# EAGLE design reprap32_drv1sch (EAGLE 5.11)
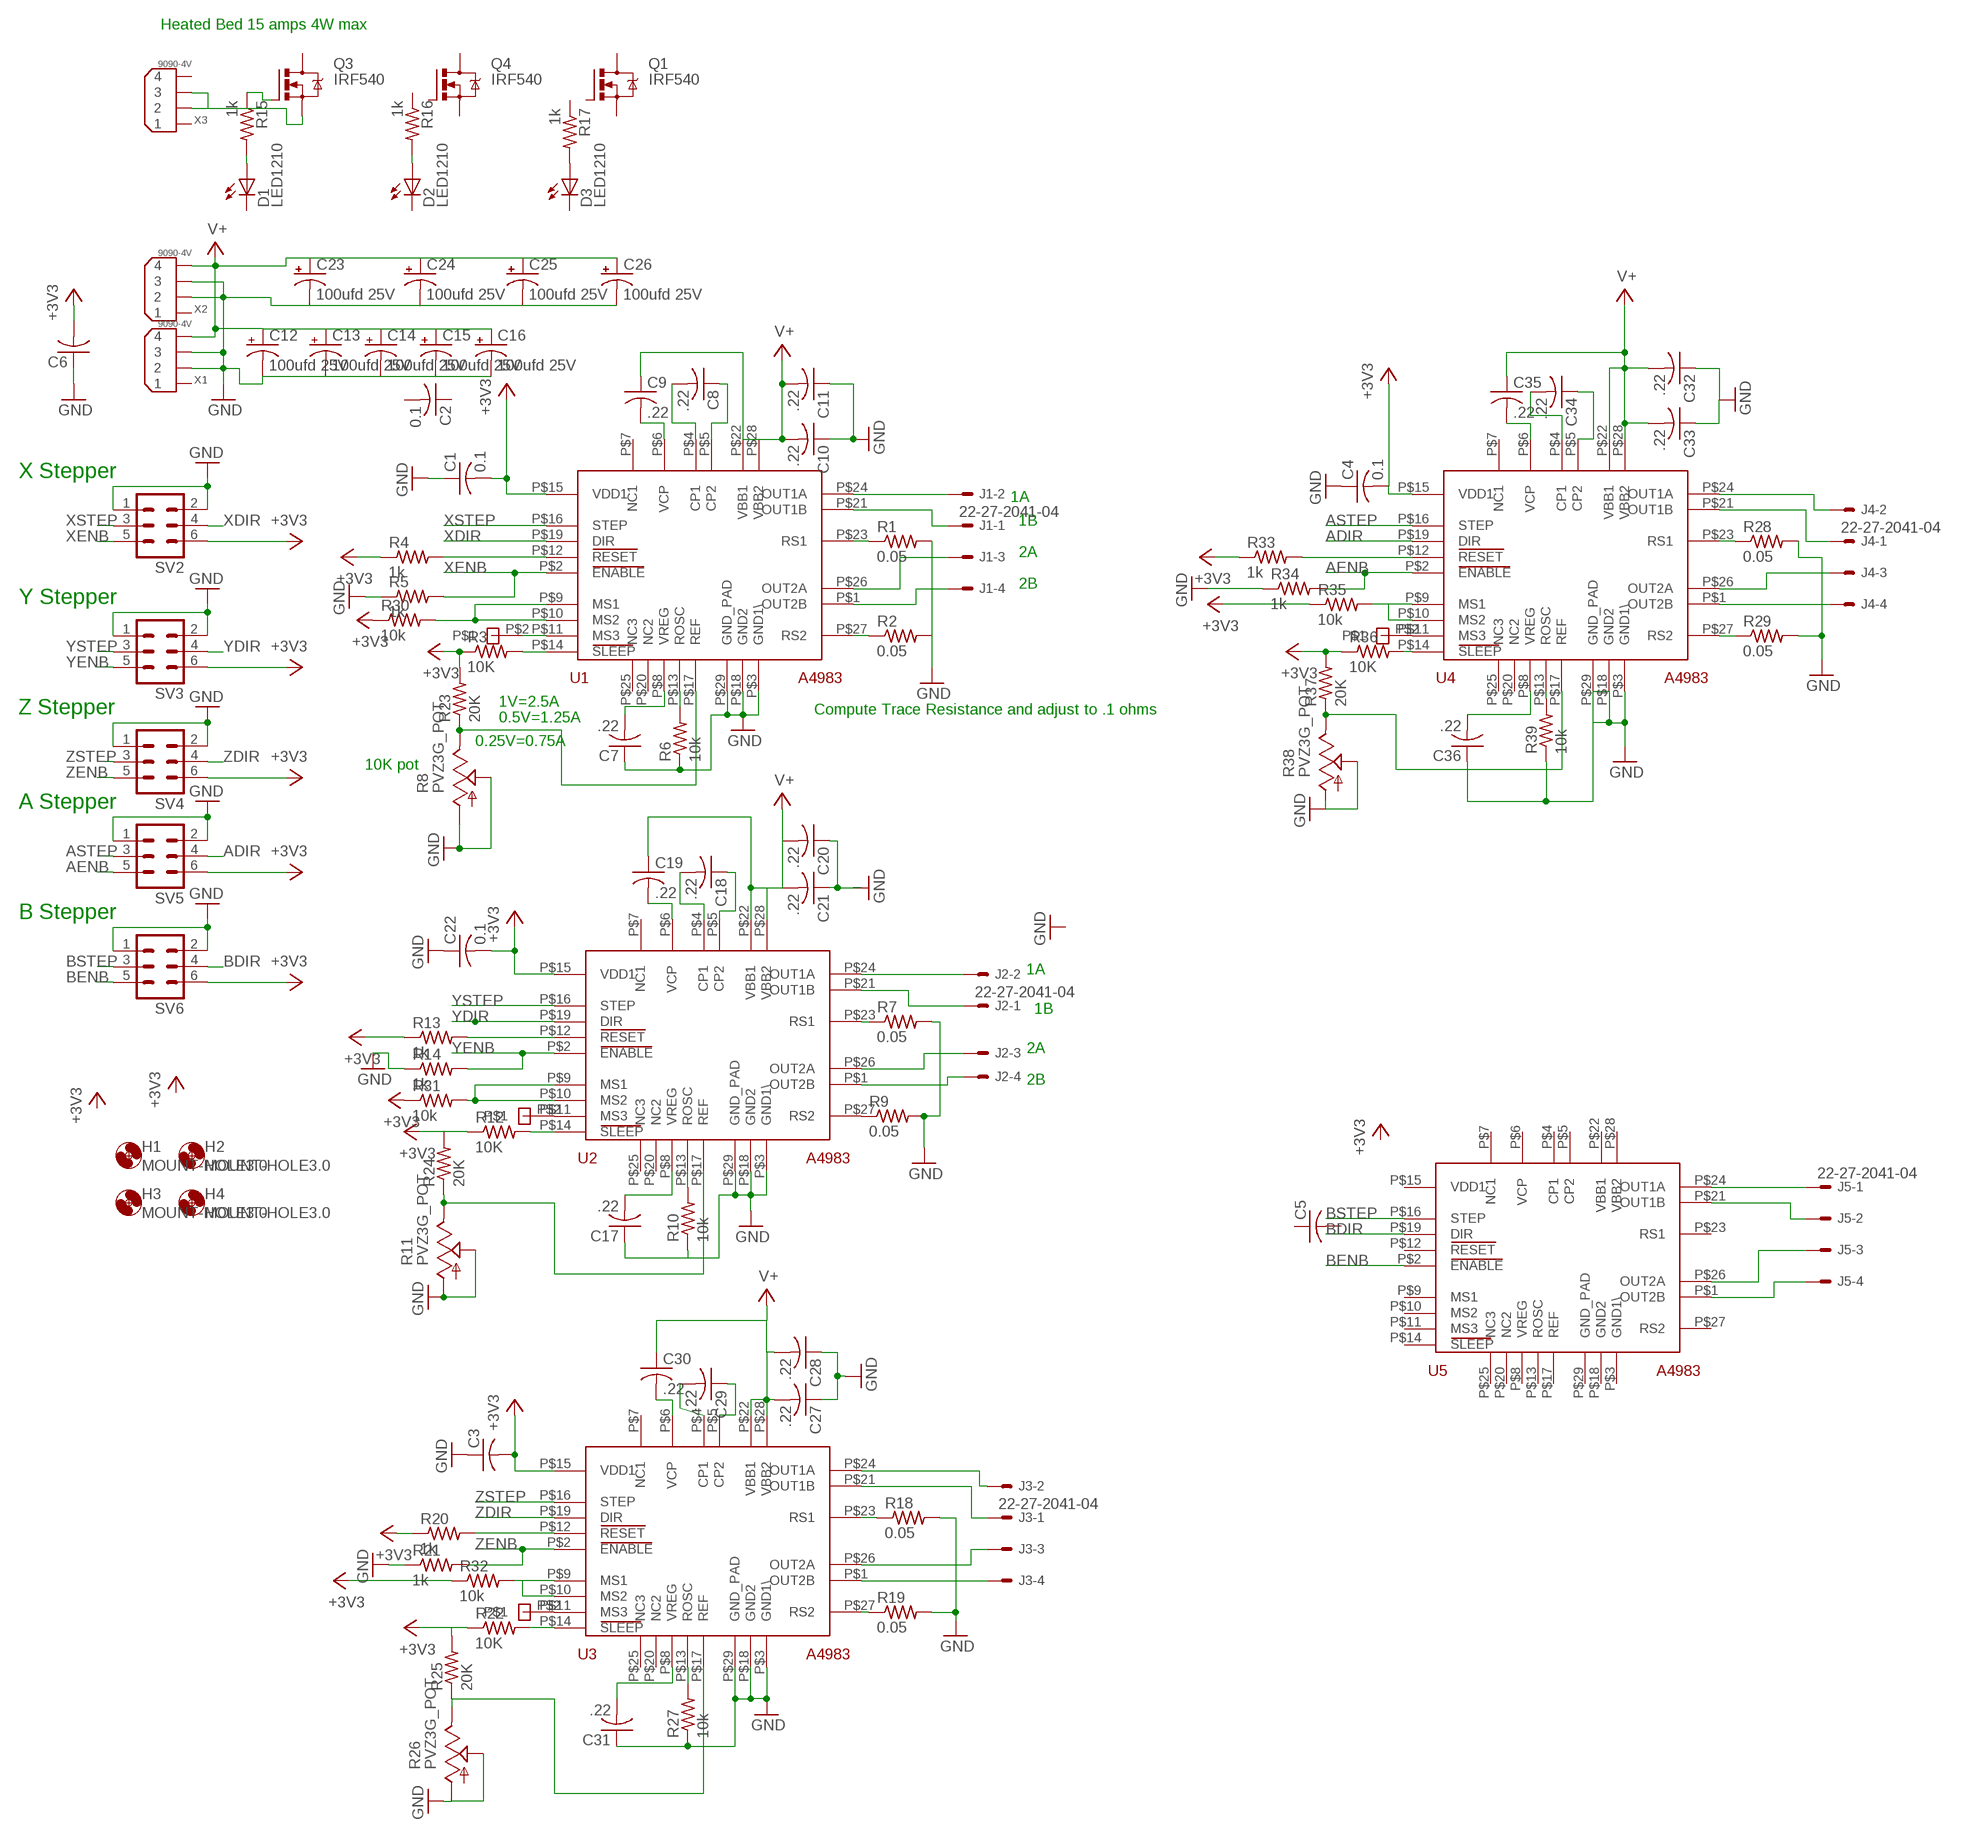
[diagram p0: schematic, sheet 1]

## Parts
C1  0.1  C-USC0603K  [C0603K]
C2  0.1  C-USC0603K  [C0603K]
C3  C-USC0603K  [C0603K]
C4  0.1  C-USC0603K  [C0603K]
C5  C-USC0603K  [C0603K]
C6  C-USC0603K  [C0603K]
C7  .22  C-USC0603K  [C0603K]
C8  .22  C-USC0603K  [C0603K]
C9  .22  C-USC0603K  [C0603K]
C10  .22  C-USC0603K  [C0603K]
C11  .22  C-USC0603K  [C0603K]
C12  100ufd 25V  CPOL-USE2-5  [E2-5]
C13  100ufd 25V  CPOL-USE2-5  [E2-5]
C14  100ufd 25V  CPOL-USE2-5  [E2-5]
C15  100ufd 25V  CPOL-USE2-5  [E2-5]
C16  100ufd 25V  CPOL-USE2-5  [E2-5]
C17  .22  C-USC0603K  [C0603K]
C18  .22  C-USC0603K  [C0603K]
C19  .22  C-USC0603K  [C0603K]
C20  .22  C-USC0603K  [C0603K]
C21  .22  C-USC0603K  [C0603K]
C22  0.1  C-USC0603K  [C0603K]
C23  100ufd 25V  CPOL-USE2-5  [E2-5]
C24  100ufd 25V  CPOL-USE2-5  [E2-5]
C25  100ufd 25V  CPOL-USE2-5  [E2-5]
C26  100ufd 25V  CPOL-USE2-5  [E2-5]
C27  .22  C-USC0603K  [C0603K]
C28  .22  C-USC0603K  [C0603K]
C29  .22  C-USC0603K  [C0603K]
C30  .22  C-USC0603K  [C0603K]
C31  .22  C-USC0603K  [C0603K]
C32  .22  C-USC0603K  [C0603K]
C33  .22  C-USC0603K  [C0603K]
C34  .22  C-USC0603K  [C0603K]
C35  .22  C-USC0603K  [C0603K]
C36  .22  C-USC0603K  [C0603K]
D1  LED1210  [LED1210]
D2  LED1210  [LED1210]
D3  LED1210  [LED1210]
H1  MOUNT-HOLE3.0  [3,0]
H2  MOUNT-HOLE3.0  [3,0]
H3  MOUNT-HOLE3.0  [3,0]
H4  MOUNT-HOLE3.0  [3,0]
J1  22-27-2041-04  [6410-04]
J2  22-27-2041-04  [6410-04]
J3  22-27-2041-04  [6410-04]
J4  22-27-2041-04  [6410-04]
J5  22-27-2041-04  [6410-04]
Q1  IRF540  [TO220BV]
Q3  IRF540  [TO220BV]
Q4  IRF540  [TO220BV]
R1  0.05  R-US_M1206  [M1206]
R2  0.05  R-US_M1206  [M1206]
R3  10K  R-US_R0603  [R0603]
R4  1k  R-US_R0603  [R0603]
R5  1k  R-US_R0603  [R0603]
R6  10k  R-US_R0603  [R0603]
R7  0.05  R-US_M1206  [M1206]
R8  PVZ3G_POT  [PVZ3G]
R9  0.05  R-US_M1206  [M1206]
R10  10k  R-US_R0603  [R0603]
R11  PVZ3G_POT  [PVZ3G]
R12  10K  R-US_R0603  [R0603]
R13  1k  R-US_R0603  [R0603]
R14  1k  R-US_R0603  [R0603]
R15  1k  R-US_R0603  [R0603]
R16  1k  R-US_R0603  [R0603]
R17  1k  R-US_R0603  [R0603]
R18  0.05  R-US_M1206  [M1206]
R19  0.05  R-US_M1206  [M1206]
R20  1k  R-US_R0603  [R0603]
R21  1k  R-US_R0603  [R0603]
R22  10K  R-US_R0603  [R0603]
R23  20K  R-US_R0603  [R0603]
R24  20K  R-US_R0603  [R0603]
R25  20K  R-US_R0603  [R0603]
R26  PVZ3G_POT  [PVZ3G]
R27  10k  R-US_R0603  [R0603]
R28  0.05  R-US_M1206  [M1206]
R29  0.05  R-US_M1206  [M1206]
R30  10k  R-US_R0603  [R0603]
R31  10k  R-US_R0603  [R0603]
R32  10k  R-US_R0603  [R0603]
R33  1k  R-US_R0603  [R0603]
R34  1k  R-US_R0603  [R0603]
R35  10k  R-US_R0603  [R0603]
R36  10K  R-US_R0603  [R0603]
R37  20K  R-US_R0603  [R0603]
R38  PVZ3G_POT  [PVZ3G]
R39  10k  R-US_R0603  [R0603]
S1  TPAD  [TPAD]
S2  TPAD  [TPAD]
S3  TPAD  [TPAD]
S4  TPAD  [TPAD]
SV2  ML6  [ML6]
SV3  ML6  [ML6]
SV4  ML6  [ML6]
SV5  ML6  [ML6]
SV6  ML6  [ML6]
U1  A4983  [QFN28]
U2  A4983  [QFN28]
U3  A4983  [QFN28]
U4  A4983  [QFN28]
U5  A4983  [QFN28]
X1  9090-4V  [9090-4V]
X2  9090-4V  [9090-4V]
X3  9090-4V  [9090-4V]

## Nets
+3V3: C1.2 C3.2 C4.2 C6.2 C22.2 R3.1 R4.1 R12.1 R13.1 R20.1 R22.1 R23.2 R24.2 R25.2 R30.1 R31.1 R32.1 R33.1 R35.1 R36.1 R37.2 SV2.6 SV3.6 SV4.6 SV5.6 SV6.6 U1.P$15(VDD1) U2.P$15(VDD1) U3.P$15(VDD1) U4.P$15(VDD1)
ADIR: SV5.4 U4.P$19(DIR)
AENB: R34.2 SV5.5 U4.P$2(ENABLE)
ASTEP: SV5.3 U4.P$16(STEP)
BDIR: SV6.4 U5.P$19(DIR)
BENB: SV6.5 U5.P$2(ENABLE)
BSTEP: SV6.3 U5.P$16(STEP)
GND [power]: C1.1 C3.1 C4.1 C6.1 C7.1 C10.1 C11.1 C12.- C13.- C14.- C15.- C16.- C17.1 C20.1 C21.1 C22.1 C23.- C24.- C25.- C26.- C27.1 C28.1 C31.1 C32.1 C33.1 C36.1 R1.2 R2.2 R5.1 R6.1 R7.2 R8.P$1 R8.P$2 R9.2 R10.1 R11.P$1 R11.P$2 R14.1 R18.2 R19.2 R21.1 R26.P$1 R26.P$2 R27.1 R28.2 R29.2 R34.1 R38.P$1 R38.P$2 R39.1 SV2.1 SV2.2 SV3.1 SV3.2 SV4.1 SV4.2 SV5.1 SV5.2 SV6.1 SV6.2 U1.P$3(GND1\) U1.P$18(GND2) U1.P$29(GND_PAD) U2.P$3(GND1\) U2.P$18(GND2) U2.P$29(GND_PAD) U3.P$3(GND1\) U3.P$18(GND2) U3.P$29(GND_PAD) U4.P$3(GND1\) U4.P$18(GND2) U4.P$29(GND_PAD) X1.2 X1.3 X2.2 X2.3
N$1: J1.2 U1.P$24(OUT1A)
N$2: J1.1 U1.P$21(OUT1B)
N$3: J1.3 U1.P$26(OUT2A)
N$4: J1.4 U1.P$1(OUT2B)
N$5: J2.1 U2.P$21(OUT1B)
N$6: J2.2 U2.P$24(OUT1A)
N$7: J2.3 U2.P$26(OUT2A)
N$8: J2.4 U2.P$1(OUT2B)
N$9: J3.2 U3.P$24(OUT1A)
N$10: J3.1 U3.P$21(OUT1B)
N$11: J3.3 U3.P$26(OUT2A)
N$12: J3.4 U3.P$1(OUT2B)
N$13: J4.2 U4.P$24(OUT1A)
N$14: J4.1 U4.P$21(OUT1B)
N$15: J4.3 U4.P$26(OUT2A)
N$16: J4.4 U4.P$1(OUT2B)
N$17: J5.1 U5.P$24(OUT1A)
N$18: J5.2 U5.P$21(OUT1B)
N$19: J5.3 U5.P$26(OUT2A)
N$20: J5.4 U5.P$1(OUT2B)
N$21: R1.1 U1.P$23(RS1)
N$22: R2.1 U1.P$27(RS2)
N$23: R6.2 U1.P$13(ROSC)
N$24: R8.P$3 R23.1 U1.P$17(REF)
N$25: R3.2 U1.P$14(SLEEP)
N$26: R4.2 U1.P$12(RESET)
N$27: C7.2 U1.P$8(VREG)
N$28: R7.1 U2.P$23(RS1)
N$29: C8.1 U1.P$5(CP2)
N$30: C8.2 U1.P$4(CP1)
N$31: C9.2 U1.P$6(VCP)
N$32: R9.1 U2.P$27(RS2)
N$33: R10.2 U2.P$13(ROSC)
N$34: C17.2 U2.P$8(VREG)
N$35 [power]: Q3.S X3.2 X3.3
N$36: R11.P$3 R24.1 U2.P$17(REF)
N$37: R12.2 U2.P$14(SLEEP)
N$38: Q3.G R15.1
N$39: D1.P$1(A) R15.2
N$40: R13.2 U2.P$12(RESET)
N$41: C18.1 U2.P$5(CP2)
N$42: C18.2 U2.P$4(CP1)
N$43: C19.2 U2.P$6(VCP)
N$44: R20.2 U3.P$12(RESET)
N$45: D2.P$1(A) R16.2
N$46: D3.P$1(A) R17.2
N$47: R18.1 U3.P$23(RS1)
N$48: R19.1 U3.P$27(RS2)
N$49: R22.2 U3.P$14(SLEEP)
N$50: R25.1 R26.P$3 U3.P$17(REF)
N$51: R29.1 U4.P$27(RS2)
N$52: C30.2 U3.P$6(VCP)
N$53: C29.2 U3.P$4(CP1)
N$54: C29.1 U3.P$5(CP2)
N$55: R27.2 U3.P$13(ROSC)
N$56: C31.2 U3.P$8(VREG)
N$57: R28.1 U4.P$23(RS1)
N$58: R31.2 U2.P$9(MS1) U2.P$10(MS2)
N$59: S2.P$2 U2.P$11(MS3)
N$60: R32.2 U3.P$9(MS1) U3.P$10(MS2)
N$61: S3.P$2 U3.P$11(MS3)
N$62: C35.2 U4.P$6(VCP)
N$63: C34.1 U4.P$5(CP2)
N$64: C34.2 U4.P$4(CP1)
N$65: R30.2 U1.P$9(MS1) U1.P$10(MS2)
N$66: S1.P$2 U1.P$11(MS3)
N$67: R33.2 U4.P$12(RESET)
N$68: R35.2 U4.P$9(MS1) U4.P$10(MS2)
N$69: S4.P$2 U4.P$11(MS3)
N$70: R36.2 U4.P$14(SLEEP)
N$71: R37.1 R38.P$3 U4.P$17(REF)
N$74: C36.2 U4.P$8(VREG)
N$76: R39.2 U4.P$13(ROSC)
V+: C9.1 C10.2 C11.2 C12.+ C13.+ C14.+ C15.+ C16.+ C19.1 C20.2 C21.2 C23.+ C24.+ C25.+ C26.+ C27.2 C28.2 C30.1 C32.2 C33.2 C35.1 U1.P$22(VBB1) U1.P$28(VBB2) U2.P$22(VBB1) U2.P$28(VBB2) U3.P$22(VBB1) U3.P$28(VBB2) U4.P$22(VBB1) U4.P$28(VBB2) X1.4 X2.4
XDIR: SV2.4 U1.P$19(DIR)
XENB: R5.2 SV2.5 U1.P$2(ENABLE)
XSTEP: SV2.3 U1.P$16(STEP)
YDIR: SV3.4 U2.P$19(DIR)
YENB: R14.2 SV3.5 U2.P$2(ENABLE)
YSTEP: SV3.3 U2.P$16(STEP)
ZDIR: SV4.4 U3.P$19(DIR)
ZENB: R21.2 SV4.5 U3.P$2(ENABLE)
ZSTEP: SV4.3 U3.P$16(STEP)
Unconnected: C2.1 C2.2 C5.1 C5.2 D1.P$2(C) D2.P$2(C) D3.P$2(C) Q1.D Q1.G Q1.S Q3.D Q4.D Q4.G Q4.S R16.1 R17.1 U1.P$7(NC1) U1.P$20(NC2) U1.P$25(NC3) U2.P$7(NC1) U2.P$20(NC2) U2.P$25(NC3) U3.P$7(NC1) U3.P$20(NC2) U3.P$25(NC3) U4.P$7(NC1) U4.P$20(NC2) U4.P$25(NC3) U5.P$3(GND1\) U5.P$4(CP1) U5.P$5(CP2) U5.P$6(VCP) U5.P$7(NC1) U5.P$8(VREG) U5.P$9(MS1) U5.P$10(MS2) U5.P$11(MS3) U5.P$12(RESET) U5.P$13(ROSC) U5.P$14(SLEEP) U5.P$15(VDD1) U5.P$17(REF) U5.P$18(GND2) U5.P$20(NC2) U5.P$22(VBB1) U5.P$23(RS1) U5.P$25(NC3) U5.P$27(RS2) U5.P$28(VBB2) U5.P$29(GND_PAD) X1.1 X2.1 X3.1 X3.4

## Notes on the sheet
- Heated Bed 15 amps 4W max
- X Stepper
- 1A
- 1B
- 2A
- 2B
- Y Stepper
- 1V=2.5A
- Z Stepper | Compute Trace Resistance and adjust to .1 ohms
- 0.5V=1.25A
- 0.25V=0.75A
- 10K pot
- A Stepper
- B Stepper
- 1A
- 1B
- 2A
- 2B

## Library data of the parts
C1-C11 C17-C22 C27-C36 = rcl:C-US: CAPACITOR, American symbol
C12-C16 C23-C26 = rcl:CPOL-US: POLARIZED CAPACITOR, American symbol
D1-D3 = dave09:LED1210
H1-H4 = holes:MOUNT-HOLE: MOUNTING HOLE with drill center marker
J1-J5 = con-molex:22-?-04: CONNECTOR wire to board 2.54 mm (.1 inch) pitch header; OC_FARNELL: unknown; OC_NEWARK: unknown
Q1 Q3 Q4 = transistor-power:IRF540: HEXFET Power MOSFET
R1-R7 R9 R10 R12-R25 R27-R37 R39 = rcl:R-US_: RESISTOR, American symbol
R8 R11 R26 R38 = dave2011:PVZ3G_POT
S1-S4 = dave27:TPAD
SV2-SV6 = con-ml:ML6: HARTING
U1-U5 = dave2011:A4983
X1-X3 = con-thomas-betts:9090-4: Disk Drive Power four position Source: Thomas & Betts Electronic Interconnects Eiropean Edition 1998

## Net classes
0 default: width 0.203 mm, clearance 0.152 mm
1 power: width 0.203 mm, clearance 0.152 mm

## Board
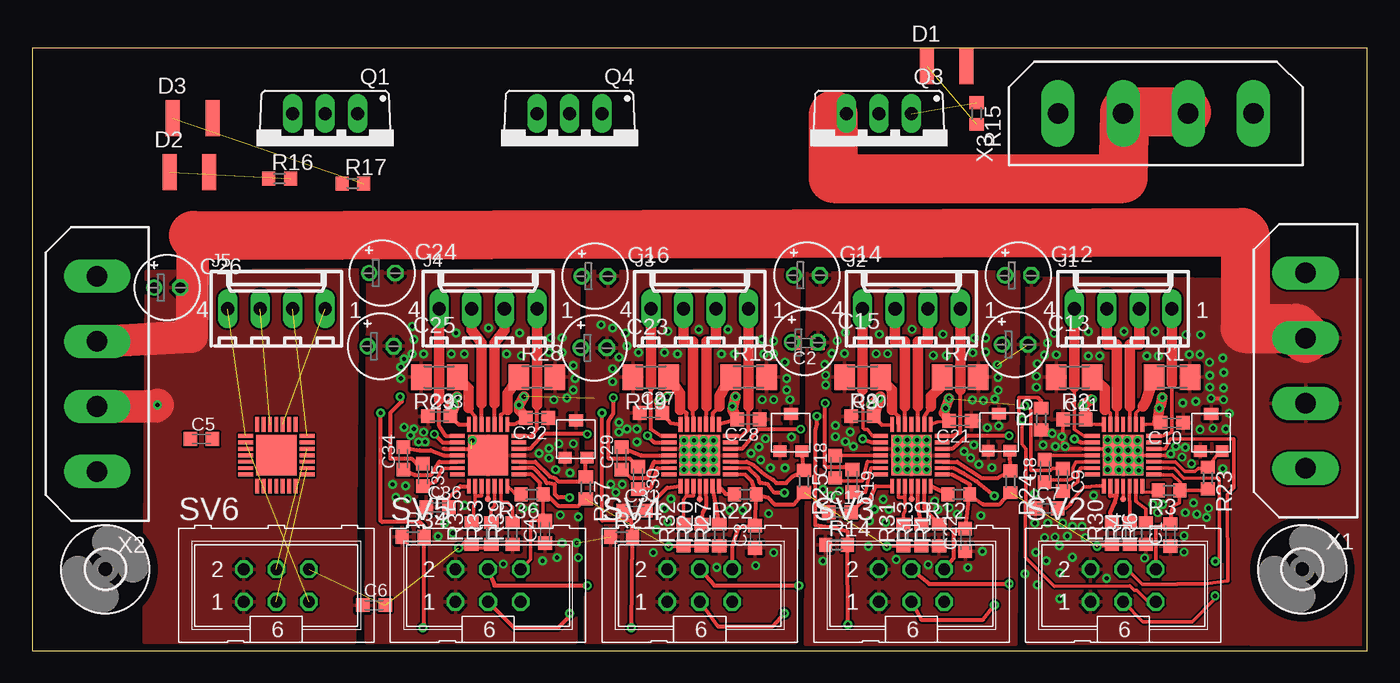
[diagram p1: board, top side]
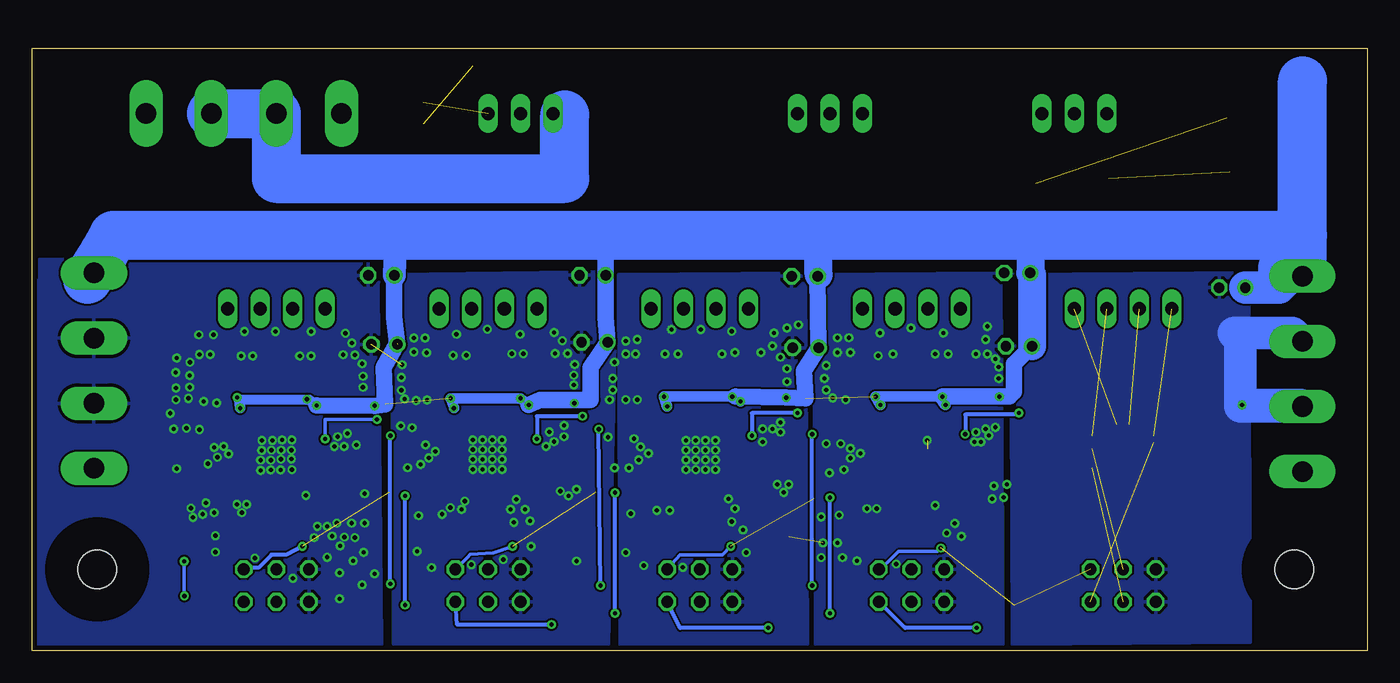
[diagram p2: board, bottom side, seen from below]

Size 104.14 x 46.99 mm. Coordinates in mm from the lower left corner, seen from the top.
Outline: 0,0 104.14,0 104.14,46.99 0,46.99 0,0
Copper layers (1*16): Top 0.0356mm / dielectric 1.5011mm / Bottom 0.0356mm
Design rules "LaenPCBOrder": minimum track width 6mil, minimum drill 13mil, track to track 6mil, track to pad 6mil, pad to pad 6mil, via to via 6mil, smd to smd 6mil, copper to edge 15mil, drill to drill 6mil, minimum pad ring 7mil, minimum via ring 7mil, stop-mask expansion 4mil, vias tented up to drill 0mil, thermal gap 10mil

### Footprints (pad centres in the part's own frame; a part is rotated, then mirrored left to right if it is on the bottom)
C0603K = smd 1.05 x 1.08: 1 -0.875,0; 2 0.875,0
E2-5 = drill 0.813 pad 1.27 round: + -1.016,0 | drill 0.813 pad 1.27 octagon: - 1.016,0
LED1210 = smd 1.1 x 2.8: P$1 -1.6,0; P$2 1.5,0
3,0 = hole 3: 0,0
6410-04 = drill 1.016 long: 1 3.81,0; 2 1.27,0; 3 -1.27,0; 4 -3.81,0
TO220BV = drill 1.016 long: D 0,-2.54; G -2.54,-2.54; S 2.54,-2.54
M1206 = smd 1.6 x 2: 1 -1.4,0; 2 1.4,0
R0603 = smd 1 x 1.1: 1 -0.85,0; 2 0.85,0
PVZ3G = smd 1 x 0.9: P$1 -0.85,-1.45; P$3 0.85,-1.45 | smd 1.1 x 0.9: P$2 0,1.45
TPAD = smd 0.457 x 0.457: P$2 0,0
ML6 = drill 0.914 octagon: 1 -2.54,-1.27; 2 -2.54,1.27; 3 0,-1.27; 4 0,1.27; 5 2.54,-1.27; 6 2.54,1.27
QFN28 = smd 1.15 x 0.3: P$1 -2.4,1.5; P$2 -2.4,1; P$3 -2.4,0.5; P$4 -2.4,0; P$5 -2.4,-0.5; P$6 -2.4,-1; P$7 -2.4,-1.5; P$15 2.4,-1.5; P$16 2.4,-1; P$17 2.4,-0.5; P$18 2.4,0; P$19 2.4,0.5; P$20 2.4,1; P$21 2.4,1.5 | smd 0.3 x 1.15: P$8 -1.5,-2.4; P$9 -1,-2.4; P$10 -0.5,-2.4; P$11 0,-2.4; P$12 0.5,-2.4; P$13 1,-2.4; P$14 1.5,-2.4; P$22 1.5,2.4; P$23 1,2.4; P$24 0.5,2.4; P$25 0,2.4; P$26 -0.5,2.4; P$27 -1,2.4; P$28 -1.5,2.4 | smd 3.15 x 3.15: P$29 0,0
9090-4V = drill 1.6 pad 2.6 long: 1 -7.62,0; 2 -2.54,0; 3 2.54,0; 4 7.62,0

### Placement (x,y rotation side)
C1  88.77,9.02 90 top
C2  60.38,24 180 top
C3  56.39,8.89 90 top
C4  40.01,9.27 90 top
C5  13.21,16.51 0 top
C6  26.67,3.56 0 top
C7  79.12,11.1 0 top
C8  78.97,14.02 90 top
C9  80.39,13.34 270 top
C10  88.9,17.78 180 top
C11  81.28,18.03 0 top
C12  76.91,29.28 0 top
C13  76.66,23.89 0 top
C14  60.43,29.29 0 top
C15  60.27,24.05 0 top
C16  43.89,29.21 0 top
C17  62.99,10.79 0 top
C18  62.64,14.35 90 top
C19  63.98,13.26 270 top
C20  64.77,18.29 0 top
C21  72.39,17.91 180 top
C22  72.77,8.64 90 top
C23  43.81,23.62 0 top
C24  27.3,29.46 0 top
C25  27.18,23.75 0 top
C26  10.54,28.32 0 top
C27  48.26,18.54 0 top
C28  55.88,18.03 180 top
C29  45.97,14.99 90 top
C30  47.24,13.46 270 top
C31  46.99,10.92 0 top
C32  39.37,18.16 180 top
C33  31.75,18.29 0 top
C34  28.96,14.99 90 top
C35  30.48,13.72 270 top
C36  31.62,11.18 0 top
D1  71.37,45.59 0 top
D2  12.32,37.34 0 top
D3  12.57,41.53 0 top
H1  5.71,6.35 0 top
H2  99.06,6.35 0 top
H3  -22.86,-17.78 0 top  (outside the outline)
H4  -31.75,-17.78 0 top  (outside the outline)
J1  85.09,26.67 0 top
J2  68.58,26.67 0 top
J3  52.07,26.67 0 top
J4  35.56,26.67 0 top
J5  19.05,26.67 0 top
Q1  22.86,39.37 180 top
Q3  66.04,39.37 180 top
Q4  41.91,39.37 180 top
R1  88.9,21.34 0 top
R2  81.28,21.34 180 top
R3  88.67,12.5 180 top
R4  85.6,9.14 90 top
R5  78.69,18.06 90 top
R6  86.87,9.14 90 top
R7  72.39,21.34 0 top
R8  91.95,17.02 0 top
R9  64.77,21.34 180 top
R10  70.74,9.02 90 top
R11  75.41,17.04 0 top
R12  72.26,12.19 180 top
R13  69.34,9.02 90 top
R14  62.74,8.26 0 top
R15  73.66,41.91 270 top
R16  19.3,36.83 0 top
R17  25.02,36.45 0 top
R18  55.88,21.34 0 top
R19  48.26,21.34 180 top
R20  52.2,9.02 90 top
R21  45.97,8.89 0 top
R22  55.63,12.19 180 top
R23  91.69,13.46 270 top
R24  76.3,13.18 270 top
R25  60.2,13.21 270 top
R26  59.18,17.02 0 top
R27  53.59,9.02 90 top
R28  39.37,21.34 0 top
R29  31.75,21.34 180 top
R30  84.2,9.14 90 top
R31  67.94,9.02 90 top
R32  50.8,9.02 90 top
R33  35.81,9.14 90 top
R34  29.72,8.89 0 top
R35  34.29,9.14 90 top
R36  38.99,12.19 180 top
R37  43.18,12.7 270 top
R38  42.42,16.51 0 top
R39  37.47,9.14 90 top
S1  85.09,11.81 0 top
S2  68.58,11.81 0 top
S3  52.07,11.81 0 top
S4  35.56,11.81 0 top
SV2  85.09,5.08 0 top
SV3  68.58,5.08 0 top
SV4  52.07,5.08 0 top
SV5  35.56,5.08 0 top
SV6  19.05,5.08 0 top
U1  85.09,15.24 0 top
U2  68.58,15.24 0 top
U3  52.07,15.24 0 top
U4  35.56,15.24 0 top
U5  19.05,15.24 0 top
X1  99.31,21.84 90 top
X2  5.08,21.59 90 top
X3  87.63,41.91 0 top

### Tracks (layer width: path | path; a pad name or v marks a point on that pad's centre or on a via)
+3V3  (via drill 0.33)  (5 unrouted)
  Top 0.254: U1.P$15 87.61,13.74 87.63,13.72 88.92,13.72 89.53,13.13 R3.1 | SV2.6 87.63,9.67 | 88.84,10.79 88.87,10.93 88.98,11.3 89.48,11.53 R3.1 | R3.1 91.58,12.5 R23.2 | v66.67,8.13 67.73,8.17 R31.1 R13.1 | v83.06,8.13 83.22,8.29 R4.1 | R20.1 R32.1 50.76,8.13 v49.66,8.13 | R35.1 34.2,8.38 33.66,8.38 v33.27,8 35.52,8 R33.1 | SV5.6 38.86,7.11 38.86,10.03 38.98,10.15 C4.2 39.84,10.31 R36.1
  Top 0.305: 88.87,10.93 C1.2 87.63,9.67 | SV3.6 71.88,7.24 71.88,9.4 72.77,9.4 | 72.77,9.4 R12.1 | R24.2 75.44,11.43 74.17,11.43 R12.1 | U2.P$15 71.75,13.72 73.15,12.95 R12.1 | 72.77,9.4 C22.2 | R25.2 59.44,11.43 57.91,11.43 57.4,11.94 R22.1 | R22.1 C3.2 55.12,9.65 54.61,8.13 SV4.6 | U3.P$15 55.63,13.72 56.13,13.21 R22.1 | v83.06,8.13 84.11,8.29 R30.1 | U4.P$15 38.97,13.74 39.62,13.08 39.62,12.41 R36.1 40.13,12.19 41.02,11.3 42.63,11.3 R37.2
  Bottom 0.254: SV3.6 70.19,7.28 69.98,7.53 68.16,7.62 v66.67,8.13 | v49.66,8.13 50.29,7.49 53.59,7.49 SV4.6 | SV5.6 37.97,6.35 36.58,7.75 33.53,7.75 v33.27,8
  Bottom 0.305: SV2.6 87.5,6.48 86.49,6.48 85.47,7.49 84.33,7.49 v83.06,8.13
ADIR  (via drill 0.33)
  Top 0.305: U4.P$19 38.85,15.74 39.88,16.89 v43.31,16.89 | v43.31,5.08 36.07,5.08 SV5.4
  Bottom 0.305: v43.31,5.08 v43.31,16.89
AENB  (via drill 0.33)
  Top 0.305: U4.P$2 32.02,16.24 v31.37,16.89 | v27.18,18.54 27.18,10.16 27.3,10.03 30.23,10.03 30.61,9.65 30.61,8.93 R34.2 30.57,1.87 v30.48,1.78
  Bottom 0.305: v31.37,16.89 31.37,18.41 27.3,18.41 v27.18,18.54 | v30.48,1.78 36.07,1.78 SV5.5
ASTEP  (via drill 0.33)
  Top 0.305: U4.P$16 39.1,14.24 40.01,13.34 40.13,13.08 40.77,12.95 40.77,12.19 41.02,11.94 v41.91,11.94 | v41.91,2.92 41.91,2.67 41.02,1.78 37.59,1.78 SV5.3
  Bottom 0.305: v41.91,2.92 v41.91,11.94
BDIR  (1 unrouted)
BENB  (1 unrouted)
BSTEP  (1 unrouted)
GND  (via drill 0.33)  (3 unrouted)
  Top 0.254: 85.14,15.24 U1.P$29 84.59,15.74 U1.P$3 80.77,15.75 80.41,16.11 | 85.14,15.24 U1.P$18 88.65,15.24 | 80.41,16.11 C11.1 | 80.41,16.11 80.35,16.17 | 85.11,15.06 84.61,15.56 | 85.14,15.24 84.64,15.74 | 85.27,15.19 84.77,15.69 | v93.09,17.3 93.12,17.02 | v91.95,19.68 92.76,19.68
  Top 0.305: 32.13,15.75 32.14,15.74 U4.P$3 34.28,15.74 34.29,15.75 | v34.34,16.41 34.39,16.41 34.42,16.38 34.29,16.38 34.29,16.51
  Top 2.54: X2.3 5.59,24.13 12.45,24.51 12.57,32.38 | X2.2 9.65,19.05 v9.78,19.18
  Top 3.81: 12.57,32.38 94.36,32.64 94.61,32.38 94.61,25.15 98.55,25.15 X1.3
  Bottom 2.54: v9.78,19.18 5.21,19.18 X2.2 9.91,19.05 9.91,24.26 10.41,24.77 5.84,24.77 5.21,24.13
  other vias: 83.87,16.43 84.63,16.43 85.39,16.41 86.21,16.41 83.92,15.65 84.71,15.65 85.47,15.65 86.23,15.62 83.92,14.96 84.73,14.94 85.52,14.86 86.31,14.86 83.87,14.12 84.76,14.1 85.52,14.1 86.31,14.07 90.25,23.11 91.08,23.11 91.85,20.55 91.82,22.5 91.85,21.46 79.88,23.09 78.97,23.06 78.41,22.38 78.33,21.41 78.33,20.55 90.42,14.58 89.2,15.93 91.74,11.13 89.84,7.7 89.84,8.97 92.91,20.5 92.1,17.35 92.91,19.58 92.94,21.69 80.57,15.93 79.81,15.93 80.31,16.69 78.84,16.05 79.55,16.94 89.74,19.33 90.75,19.43 92.86,22.83 93.37,18.52 91.08,17.25 89.94,15.85 92.86,14.2 91.59,10.39 90.83,10.64 80.16,4.04 78.41,5.13 77.42,5.99 78.28,7.67 79.1,7.01 80.16,6.07 63.35,23.19 62.38,23.19 61.82,22.33 61.9,21.49 61.9,20.73 73.38,23.24 74.37,23.29 73.33,19.56 74.19,19.51 75.29,22.3 75.34,21.31 75.34,20.32 89.69,15.09 88.8,15.34 78.21,12.24 78.21,9.96 79.22,9.96 80.37,9.96 81.13,9.7 81.89,9.7 82.78,12.12 79.78,8.86 87.4,11.4 87.78,10.77 88.16,11.4 89.94,10.77 90.58,11.53 80.11,8.18 78.97,8.81 80.75,8.94 81.13,7.29 83.79,5.64 82.14,8.81 73.46,16.05 72.69,15.54 73.2,15.04 73.84,14.53 74.85,14.27 67.49,16.43 68.25,16.43 69.01,16.43 69.77,16.43 67.49,15.67 68.25,15.67 69.01,15.67 69.77,15.67 67.49,14.91 68.25,14.91 69.01,14.91 69.77,14.91 67.49,14.15 68.25,14.15 69.01,14.15 69.77,14.15 63.8,17.07 62.66,17.58 62.66,16.69 63.42,16.31 64.06,15.93 65.84,23.16 66.73,23.16 70.28,23.04 71.3,23.04 71.04,24.69 68.63,25.07 66.09,24.69 63.42,24.82 62.79,24.18 86.94,22.99 87.83,22.99 82.37,22.99 83.26,22.99 82.37,24.89 85.17,24.89 87.58,24.89 79.71,24.77 74.37,24.38 73.48,24.38 89.99,24.64 91.14,24.64 62.31,12.06 61.67,12.57 62.94,12.45 73.99,10.54 61.67,6.99 66.37,11.81 65.23,8.13 74.12,7.75 72.97,6.48 74.5,17.4 75.39,17.53 75.08,19.63 45.14,12.98 46.02,12.98 45.52,12.34 47.29,23.27 45.77,22.89 45.26,22 45.26,20.98 46.28,24.79 46.41,23.77 49.33,23.27 50.34,23.14 49.58,24.92 51.99,25.04 54.28,25.04 53.77,23.14 54.79,23.14 57.07,23.14 56.95,24.28 57.84,24.16 57.84,23.14 56.95,19.58 57.84,19.58 57.2,16.54 59.23,16.66 56.06,15.39 56.69,15.9 56.82,14.88 57.58,14.25 58.72,14.25 48.69,9.42 48.44,7.65 56.44,6.63 57.84,7.65 57.45,10.69 58.85,20.35 58.85,21.23 58.72,22.5 59.11,19.58 79.2,24 50.85,16.41 51.61,16.41 52.37,16.41 53.14,16.41 50.85,15.65 51.61,15.65 52.37,15.65 53.14,15.65 52.37,14.88 50.85,14.88 51.61,14.88 53.14,14.88 50.85,14.12 51.61,14.12 52.37,14.12 53.14,14.12 86.77,7.21 70.38,11.66 70.64,11.02 71.53,11.15 69.88,6.71 66.83,11.02 65.68,11.02 66.57,10.01 65.3,10.13 72.16,10.64 67.39,7.11 53.39,6.5 54.41,10.95 55.42,10.95 49.83,11.84 49.33,11.07 49.58,10.06 39.8,7.01 41.33,8.41 40.94,7.26 41.2,10.57 38.28,11.07 39.04,11.07 28.12,12.98 29.13,12.85 28.37,11.96 29.26,11.84 33.71,11.33 32.18,9.93 36.75,6.76 31.67,8.92 32.82,9.17 39.55,15.39 40.31,15.77 40.31,15.01 41.96,13.87 29.64,23.14 32.69,23.14 33.71,23.14 33.07,24.79 37.01,23.14 38.15,23.01 38.02,24.79 35.61,25.17 40.31,23.27 41.33,23.27 40.44,24.41 41.33,24.41 42.21,22.25 42.34,21.23 42.21,20.35 41.71,19.71 40.69,19.58 30.53,23.14 28.75,22.12 28.75,21.23 29.01,22.76 44.37,25.43 45.26,25.17 29.64,25.3 29.77,24.28 45.77,17.81 46.41,17.3 47.17,17.3 47.17,16.28 45.77,17.04 30.15,16.28 29.51,16.79 30.53,17.04 30.66,16.28 29.77,17.3 29.01,17.42 40.82,14.12 41.07,16.15 42.21,16.15 42.6,10.44 42.47,8.41 42.6,7.26
  pour Top: 77.6,28.45 77.65,0.58 103.68,0.46 103.68,28.91 77.5,29.06 77.52,29.03
  pour Bottom: 77.11,29.01 103.78,28.88 103.78,0.51 76.89,0.51 77.14,28.32
  pour Bottom: 58.8,29.59 76.07,29.34 75.95,0.51 59.18,0.51 58.55,29.59
  pour Bottom: 77.75,30.4 103.53,30.53 103.78,0.51 77.65,0.64 77.65,28.32
  pour Top: 60.45,29.46 76.96,29.59 76.71,0.51 60.33,0.51
  pour Bottom: 44.07,29.46 58.42,29.34 58.29,0.51 43.69,0.51 43.81,29.46
  pour Bottom: 28.83,29.46 43.18,29.34 43.05,0.51 28.45,0.51 28.57,29.46
  pour Bottom: 13.46,29.46 27.81,29.34 27.69,0.51 9.14,0.64 9.27,29.46
  pour Top: 43.31,29.59 59.82,29.72 59.56,0.64 43.18,0.64
  pour Top: 26.16,29.59 42.67,29.72 42.42,0.64 26.04,0.64
  pour Top: 8.89,29.59 25.4,29.72 25.15,0.64 8.76,0.64
N$1
  Top 0.254: U1.P$24 85.6,19.05
  Top 0.813: 85.6,19.05 85.6,23.88 86.36,23.88 J1.2
N$2
  Top 0.254: U1.P$21 88.11,16.74 88.14,16.76 88.9,17.02 88.9,20.83
  Top 0.813: 88.9,20.83 J1.1
N$3
  Top 0.254: U1.P$26 84.58,19.05
  Top 0.813: 84.58,19.05 84.58,23.88 83.82,23.88 J1.3
N$4
  Top 0.254: U1.P$1 82.07,16.74 82.04,16.76 81.28,17.25 81.28,20.57
  Top 0.813: 81.28,20.57 J1.4
N$5
  Top 0.305: 72.39,20.32 72.39,17.02 71.75,16.76 U2.P$21
  Top 0.813: 72.39,20.32 J2.1
N$6
  Top 0.305: U2.P$24 69.09,19.05
  Top 0.813: J2.2 69.85,24.13 69.09,24.13 69.09,19.05
N$7
  Top 0.305: U2.P$26 68.07,19.05
  Top 0.813: J2.3 67.31,24.13 68.07,24.13 68.07,19.05
N$8
  Top 0.254: 64.77,20.32 64.8,17.37 64.9,17.27 65.15,17.27 65.53,16.76 U2.P$1
  Top 0.813: 64.77,20.32 J2.4
N$9
  Top 0.305: U3.P$24 52.58,19.05
  Top 0.813: J3.2 53.34,24.13 52.58,24.13 52.58,19.05
N$10
  Top 0.305: 55.88,19.05 55.88,17.27 55.37,16.76 U3.P$21
  Top 0.813: 55.88,19.05 J3.1
N$11
  Top 0.305: U3.P$26 51.56,19.05
  Top 0.813: J3.3 50.8,24.13 51.56,24.13 51.56,19.05
N$12
  Top 0.305: 48.26,20.7 48.26,17.27 49.02,16.76 U3.P$1
  Top 0.813: 48.26,20.7 J3.4
N$13
  Top 0.305: U4.P$24 36.07,19.3
  Top 0.813: J4.2 36.83,25.02 36.07,24 36.07,19.3
N$14
  Top 0.305: 39.37,19.18 39.37,17.27 38.99,16.76 U4.P$21
  Top 0.813: 39.37,19.18 J4.1
N$15
  Top 0.305: U4.P$26 35.05,19.3
  Top 0.813: J4.3 34.29,25.02 35.05,24 35.05,19.3
N$16
  Top 0.305: 31.75,19.56 31.75,17.53 32.26,16.76 U4.P$1
  Top 0.813: 31.75,19.56 J4.4
N$17  (1 unrouted)
N$18  (1 unrouted)
N$19  (1 unrouted)
N$20  (1 unrouted)
N$21
  Top 0.254: U1.P$23 86.09,18.53 86.61,19.05
  Top 0.813: 86.61,19.05 86.87,19.43 R1.1
N$22
  Top 0.254: U1.P$27 84.09,18.53 83.67,18.8
  Top 0.813: 83.67,18.8 83.67,20.45 R2.1
N$23
  Top 0.254: 86.09,11.65 U1.P$13 | 86.09,11.65 86.11,11.68 | 86.09,11.65 86.87,11.05 R6.2
N$24
  Top 0.254: U1.P$17 89.15,14.74 89.92,13.97 90.68,13.97 90.93,14.22 91.61,14.22 R23.1 92.42,15.33 R8.P$3
N$25
  Top 0.254: U1.P$14 86.59,12.34 87.73,12.37 87.8,12.45 R3.2
N$26
  Top 0.254: U1.P$12 85.59,11.69 85.6,11.68 R4.2
N$27
  Top 0.254: U1.P$8 82.94,12.84 82.6,12.83 82.55,12.78 82.04,12.79 81.2,11.84 80.95,11.38 80.62,11.1 C7.2
N$28
  Top 0.305: U2.P$23 69.6,18.29 70.1,19.05
  Top 0.813: R7.1 70.99,20.7 70.1,19.81 70.1,19.05
N$29
  Top 0.254: 81.8,14.74 U1.P$5 | 81.8,14.74 81.79,14.73 | 81.8,14.74 81.39,14.74 81.18,14.28 81.18,13.49 80.87,13.31 78.8,13.31 C8.1
N$30
  Top 0.254: U1.P$4 79.2,15.24 79.15,15.19 78.81,15.19 C8.2
N$31
  Top 0.254: U1.P$6 81.8,14.24 81.56,13.87 81.56,13.18 81.05,12.8 80.53,12.46 C9.2
N$32
  Top 0.305: U2.P$27 67.56,18.29 67.06,18.8
  Top 0.813: R9.1 66.17,21.21 67.06,20.32 67.06,18.8
N$33
  Top 0.305: U2.P$13 69.6,11.05 R10.2
N$34
  Top 0.305: U2.P$8 65.79,12.83 65.41,11.94 65.28,11.81 64.64,11.56 C17.2
N$35
  Top 0.61: 62.48,41.78 Q3.S
  Top 2.54: 90.04,42.04 X3.3
  Top 3.81: 62.48,41.78 62.48,36.83 85.09,36.83 85.22,42.04 90.04,42.04
  Bottom 3.81: X3.3 X3.2 85.09,36.83 62.61,36.83 62.61,41.78
N$36
  Top 0.305: R11.P$3 R24.1 75.31,13.46 74.04,13.46 72.14,14.73 U2.P$17
N$37
  Top 0.305: U2.P$14 R12.2
N$38  (1 unrouted)
N$39  (1 unrouted)
N$40
  Top 0.305: R13.2 69.09,11.3 U2.P$12
N$41
  Top 0.254: U2.P$5 65.15,14.76 64.75,13.26 62.97,13.26 C18.1
N$42
  Top 0.254: C18.2 U2.P$4
N$43
  Top 0.254: C19.2 65,12.34 65.41,14.25 65.53,14.25 U2.P$6
N$44
  Top 0.305: R20.2 52.32,10.79 52.58,11.3 U3.P$12
N$45  (1 unrouted)
N$46  (1 unrouted)
N$47
  Top 0.305: U3.P$23 53.09,18.54 53.59,19.05
  Top 0.813: R18.1 53.59,19.81 53.59,19.05
N$48
  Top 0.305: 50.55,18.8 51.05,18.54 U3.P$27
  Top 0.813: R19.1 50.55,20.07 50.55,18.8
N$49
  Top 0.305: R22.2 54.1,12.19 U3.P$14
N$50
  Top 0.305: R26.P$3 R25.1 59.31,13.59 58.8,13.08 58.04,13.08 57.78,13.34 57.15,13.72 56.26,14.48 55.75,14.73 U3.P$17
N$51
  Top 0.305: 34.04,18.92 34.54,18.29 U4.P$27
  Top 0.813: R29.1 34.04,20.45 34.04,18.92
N$52
  Top 0.305: U3.P$6 48.77,14.22 48.26,12.7 C30.2
N$53
  Top 0.305: U3.P$4 47.5,15.24 C29.2
N$54
  Top 0.305: U3.P$5 48.51,14.73 48.01,13.46 46.74,13.46 C29.1
N$55
  Top 0.305: R27.2 U3.P$13
N$56
  Top 0.305: U3.P$8 49.53,12.7 48.77,11.94 C31.2
N$57
  Top 0.305: 37.08,18.8 36.58,18.41 U4.P$23
  Top 0.813: R28.1 37.08,20.07 37.08,18.8
N$58
  Top 0.254: U2.P$9 67.56,12.82 67.56,11.94 68.07,11.94 68.08,11.95 | 68.08,11.95 U2.P$10 | R31.2 67.94,10.63 68.07,10.92 68.07,11.43 68.08,11.93 68.08,11.95
N$59
  Top 0.254: S2.P$2 U2.P$11
N$60
  Top 0.254: U3.P$9 51.05,12.82 51.05,12.06 | 51.05,12.06 51.56,12.06 51.57,12.07 U3.P$10 | 51.05,12.06 50.8,11.81 R32.2
N$61
  Top 0.254: S3.P$2 U3.P$11
N$62
  Top 0.305: C35.2 31.5,13.21 32,14.22 U4.P$6
N$63
  Top 0.305: U4.P$5 31.75,14.73 31.11,13.72 29.84,13.72 C34.1
N$64
  Top 0.305: C34.2 30.23,15.62 31.11,15.62 32.13,15.24 U4.P$4
N$65
  Top 0.305: U1.P$10 84.58,12.06 | U1.P$9 84.09,12.08 84.07,12.06 84.58,12.06 | 84.58,12.06 84.45,11.56 84.07,10.79 R30.2
N$66
  Top 0.254: S1.P$2 U1.P$11
N$67
  Top 0.254: U4.P$12 36.06,11.31 36.07,11.3 35.81,11.05 R33.2
N$68
  Top 0.254: U4.P$9 34.56,12.08 34.54,12.06 | 34.54,12.06 35.05,12.06 U4.P$10 | 34.54,12.06 34.54,11.43 34.42,11.3 34.42,10.12 R35.2
N$69
  Top 0.254: S4.P$2 U4.P$11
N$70
  Top 0.254: R36.2 37.72,12.19 37.47,12.45 37.45,12.45 U4.P$14
N$71
  Top 0.305: U4.P$17 39.23,14.74 40.39,13.59 40.77,13.46 41.02,13.21 42.84,13.21 R37.1 43.18,14.97 R38.P$3
N$74
  Top 0.305: C36.2 32.5,11.92 33.4,12.83 34.05,12.83 U4.P$8
N$76
  Top 0.254: U4.P$13 36.56,11.57 36.58,11.56 37.08,11.56 37.47,11.18 R39.2
V+  (via drill 0.33)  (3 unrouted)
  Top 0.254: U1.P$28 82.92,17.64 82.14,17.78 C11.2 | U1.P$22 86.88,17.64 87.55,17.7 87.69,17.7 C10.2 87.77,17.77 | v81.94,19.13 82.16,18.68 | C9.1 79.56,14.21 79.43,14.07 77.88,14.05 77.88,18.8 v77.42,19.1 | 82.6,19.61 v82.7,19.61 | U2.P$22 70.59,17.86 C21.2
  Top 0.305: U2.P$28 66.27,17.63 C20.2 | C19.1 63.37,14.35 61.85,14.35 v61.85,19.3 | C28.2 U3.P$22 | C27.2 49.78,17.78 U3.P$28 | C30.1 46.61,14.99 44.96,14.99 44.96,17.91 45.34,18.54 v45.33,19.73 | C33.2 33.27,17.65 U4.P$28 | C32.2 37.59,17.65 U4.P$22 | C35.1 29.99,14.59 29.59,14.99 27.94,14.99 27.94,18.54 28.83,19.43 28.83,19.68 v28.7,19.81
  Top 0.813: 82.16,18.68 C11.2 | 87.77,17.77 v87.91,18.92 88.01,19.18 v88.14,19.76 | v81.94,19.13 82.6,19.61 | C21.2 71.12,18.54 v71.5,19.68 | v65.41,19.18 66.17,19.81 66.04,19.56 C20.2 | C28.2 54.61,18.8 v54.86,19.81 | v49.53,19.81 v48.9,19.43 C27.2 | C32.2 38.49,18.27 37.97,18.8 v37.97,19.18 v38.35,19.81 | v32.89,19.18 32.89,18.94 C33.2 32.62,19.29 v33.15,19.81
  Bottom 0.305: v61.85,19.3 61.47,19.56 | 43.81,19.68 43.81,22.35 43.18,22.99 43.18,28.96 42.8,29.34
  Bottom 0.813: v87.91,18.92 87.99,19.58 82.55,19.56 v81.94,19.13 | v71.25,18.92 v71.5,19.68 v66.04,19.68 v65.41,19.18 | v54.61,19.05 v54.86,19.81 49.28,19.81 v48.9,19.43 | v37.97,19.18 v38.35,19.81 v33.15,19.81 33.15,19.43 v32.89,19.18
  Bottom 1.27: v81.94,19.13 v77.42,19.1 76.61,19.2 76.71,22.1 75.67,23.95 75.89,26.01 C12.+ | v65.41,19.18 64.52,19.56 61.47,19.56 60.58,19.56 60.58,22.1 C15.+ 59.44,26.04 59.41,26.06 C14.+ 59.44,31.55 | 49.28,19.81 v45.34,19.73 v45.33,19.73 43.81,19.68 43.94,21.84 C23.+ C16.+ | v33.15,19.81 v28.7,19.81 27.94,19.81 27.56,20.19 27.56,22.35 C25.+
  Bottom 1.778: C12.+ 75.82,31.5 75.56,32.38 | X2.4 5.08,29.84
  Bottom 2.184: 26.16,32.38 26.42,32.26 26.29,32.13 C24.+ 26.16,29.34 C25.+ | 42.8,29.34 42.8,31.24
  Bottom 2.54: C26.+ 6.86,28.32 5.33,29.84 | 99.82,28.96 X1.4
  Bottom 3.81: 6.6,29.84 5.33,29.84 5.08,29.84 5.08,32.38 | 5.08,32.38 5.08,44.45 | 99.82,28.96 98.55,30.99 97.79,32.38 75.56,32.38 26.16,32.38 5.08,32.38
XDIR
  Top 0.254: 88.38,15.74 U1.P$19 | 88.38,15.74 88.39,15.75 | SV2.4 85.04,6.35 85.01,6.38 85.39,6.38 86.59,5.18 89.31,5.18 89.33,5.21 91.52,5.21 93.27,5.44 93.22,12.19 93.73,12.7 93.73,16.51 88.76,16.54 88.38,15.74
XENB  (via drill 0.33)
  Top 0.254: SV2.5 87.07,3.81 86.16,4.72 85.95,4.72 85.62,5.05 79.73,5.03 77.47,7.29 77.52,15.75 77.19,16.13 77.2,16.31 77.2,16.95 v77.24,18.03 76.96,18.01 76.96,19.76 78.44,19.74
  Top 0.305: U1.P$2 81.79,16.26 v81.28,16.51 | 78.44,19.74 78.69,19.48 R5.2
  Bottom 0.254: v81.28,16.51 81.28,18.03 v77.24,18.03
XSTEP  (via drill 0.33)
  Top 0.254: 88.65,14.22 88.63,14.24 U1.P$16 89.06,14.21 89.84,13.44 92.51,13.46 92.58,13.39 92.58,7.26 v92.28,6.96 | v92.25,4.27 92.25,4.04 90.47,2.26 86.64,2.26 SV2.3
  Bottom 0.254: v92.28,6.96 92.28,4.29 v92.25,4.27
YDIR  (via drill 0.33)
  Top 0.305: U2.P$19 71.75,15.75 72.9,16.76 73.79,16.76 v76.2,16.76 | v76.2,5.21 69.98,5.21 SV3.4
  Bottom 0.305: v76.2,5.21 v76.2,16.76
YENB  (via drill 0.33)
  Top 0.305: v64.77,16.51 65.53,16.26 U2.P$2 | v61.21,18.29 61.21,17.65 61.09,17.14 61.09,9.78 62.74,9.53 63.63,9.27 R14.2 v63.63,2.03
  Bottom 0.305: v64.77,16.51 64.77,18.29 v61.21,18.29 | SV3.5 70.99,2.03 v63.63,2.03
YSTEP  (via drill 0.33)
  Top 0.305: U2.P$16 71.88,14.22 72.64,13.84 73.66,13.21 v75.06,12.06 | v75.06,3.56 74.17,2.41 69.34,2.41 SV3.3
  Bottom 0.305: v75.06,3.56 v75.06,12.06
ZDIR  (via drill 0.33)
  Top 0.305: U3.P$19 55.37,15.75 56.64,17.27 v59.94,17.27 | v59.82,5.08 53.21,5.08 SV4.4
  Bottom 0.305: v59.82,5.08 v59.94,17.27
ZENB  (via drill 0.33)
  Top 0.305: U3.P$2 48.51,16.26 v48.01,16.76 | v46.74,1.78 R21.2 46.74,10.16 44.45,10.16 v44.45,18.54
  Bottom 0.305: v48.01,16.76 48.01,18.54 v44.45,18.54 | SV4.5 53.59,1.78 v46.74,1.78
ZSTEP  (via drill 0.33)
  Top 0.305: U3.P$16 55.88,14.22 56.64,13.46 56.77,13.08 57.4,12.95 57.91,12.32 v58.67,12.32 | v58.67,2.92 57.78,1.91 53.47,1.91 SV4.3
  Bottom 0.305: v58.67,2.92 v58.67,12.32

### Text on the board
tDocu: RED | GRN | YEL | BLUE